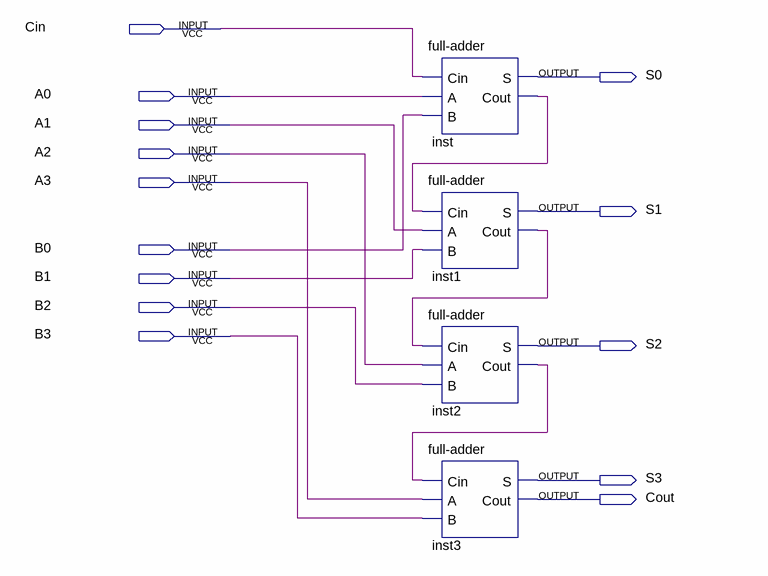
[diagram p0: schematic sheet]
// Quartus schematic full-adder-4-bit.bdf as structural Verilog: 4 symbols, 14 pins
module \full-adder-4-bit  (
  input  Cin,
  input  A0,
  input  A1,
  input  A2,
  input  A3,
  input  B0,
  input  B1,
  input  B2,
  input  B3,
  output S0,
  output S1,
  output S2,
  output S3,
  output Cout
);

  wire inst1_cout, inst2_cout, inst_cout;

  \full-adder  inst (.Cin(Cin), .A(A0), .B(B0), .S(S0), .Cout(inst_cout));
  \full-adder  inst1 (.Cin(inst_cout), .A(A1), .B(B1), .S(S1), .Cout(inst1_cout));
  \full-adder  inst2 (.Cin(inst1_cout), .A(A2), .B(B2), .S(S2), .Cout(inst2_cout));
  \full-adder  inst3 (.Cin(inst2_cout), .A(A3), .B(B3), .S(S3), .Cout(Cout));
endmodule
